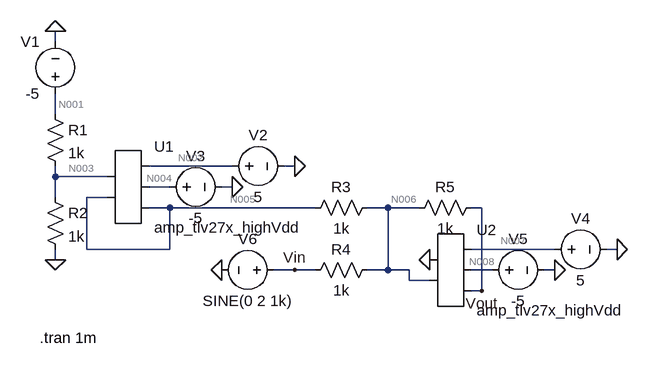
[diagram p0: schematic Lab6_2.asc]
* Lab6_2.asc
V1 N001 0 -5
V2 N002 0 5
V3 N004 0 -5
R1 N001 N003 1k
R2 N003 0 1k
* U1: amp_tlv27x_highVdd (symbol AutoGenerated\amp_tlv27x_highVdd not available, pins judged from their places): pin1=N003 pin2=N005 pin3=N002 pin4=N004 pin5=N005
R3 N006 N005 1k
R4 N006 Vin 1k
R5 Vout N006 1k
* U2: amp_tlv27x_highVdd (symbol AutoGenerated\amp_tlv27x_highVdd not available, pins judged from their places): pin1=0 pin2=N006 pin3=N007 pin4=N008 pin5=Vout
V4 N007 0 5
V5 N008 0 -5
V6 Vin 0 SINE(0 2 1k)
.tran 1m
.backanno
.end

* Results of the author's LTspice run, read from the files saved beside the schematic
* Operating Point, zero values left out:
*   V(n001) = -5 V
*   V(n002) = 5 V
*   V(n004) = -5 V
*   V(n003) = -2.5 V
*   V(n005) = -2.499 V
*   V(n006) = -343.4 µV
*   V(vout) = 2.498 V
*   V(n008) = -5 V
*   V(n007) = 5 V
*   I(R5) = 2.499 mA
*   I(R4) = -343.4 nA
*   I(R3) = 2.499 mA
*   I(R2) = -2.5 mA
*   I(R1) = -2.5 mA
*   I(V6) = -343.4 nA
*   I(V5) = 67.78 µA
*   I(V4) = -67.78 µA
*   I(V3) = 67.78 µA
*   I(V2) = -67.77 µA
*   I(V1) = 2.5 mA
*   Ix(u1:1) = -9.402 pA
*   Ix(u1:2) = -9.4 pA
*   Ix(u1:3) = 67.77 µA
*   Ix(u1:4) = -67.78 µA
*   Ix(u1:5) = 2.499 mA
*   Ix(u2:1) = -6.9 pA
*   Ix(u2:2) = -6.901 pA
*   Ix(u2:3) = 67.78 µA
*   Ix(u2:4) = -67.78 µA
*   Ix(u2:5) = -2.499 mA
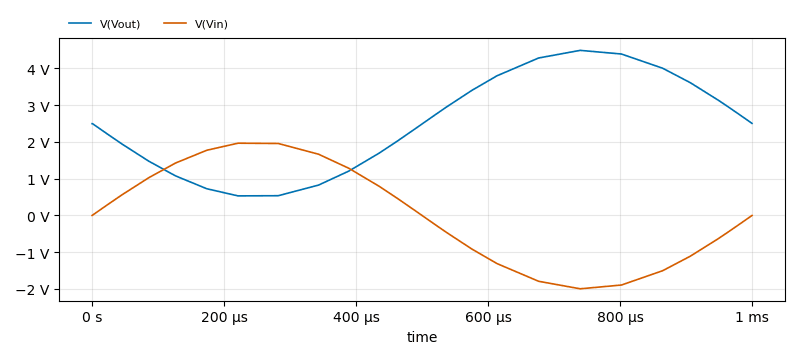
[diagram p1: Transient Analysis of Lab6_2.asc, plotted from the saved traces]
* Transient Analysis, 1 run:
*   V(Vout): min 533.1 mV, max 4.493 V, average 2.497 V, rms 2.866 V, last 2.507 V
*   V(Vin): min -1.996 V, max 1.967 V, average 1.323 mV, rms 1.406 V, last 0 V